# EAGLE design Plata2 (EAGLE 7.5.0)
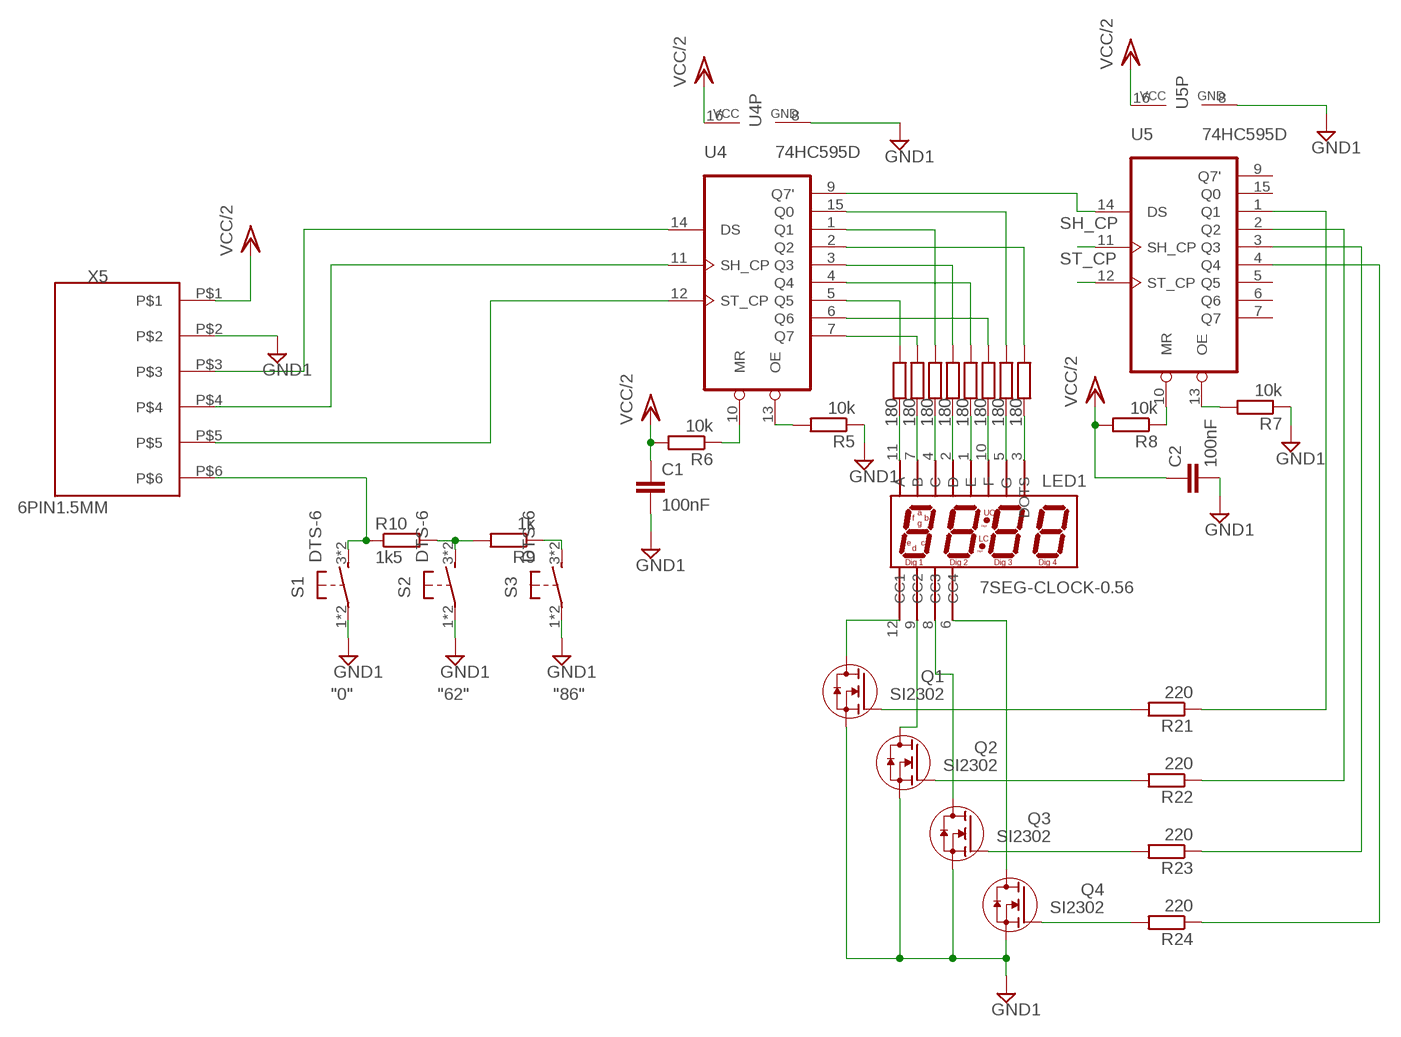
[diagram p0: schematic, sheet 1]

## Parts
C1  100nF  C-EUC0603  [C0603]
C2  100nF  C-EUC0603  [C0603]
LED1  7SEG-CLOCK-0.56  [7SEG_4DIG_0.56]
Q1  SI2302  [SOT-23-GSD]
Q2  SI2302  [SOT-23-GSD]
Q3  SI2302  [SOT-23-GSD]
Q4  SI2302  [SOT-23-GSD]
R5  10k  R-EU_R0805  [R0805]
R6  10k  R-EU_R0805  [R0805]
R7  10k  R-EU_R0805  [R0805]
R8  10k  R-EU_R0805  [R0805]
R9  1k  R-EU_R0805  [R0805]
R10  1k5  R-EU_R0805  [R0805]
R17  180  R-EU_R0805  [R0805]
R18  180  R-EU_R0805  [R0805]
R19  180  R-EU_R0805  [R0805]
R20  180  R-EU_R0805  [R0805]
R21  220  R-EU_R0805  [R0805]
R22  220  R-EU_R0805  [R0805]
R23  220  R-EU_R0805  [R0805]
R24  220  R-EU_R0805  [R0805]
R25  180  R-EU_R0805  [R0805]
R26  180  R-EU_R0805  [R0805]
R27  180  R-EU_R0805  [R0805]
R28  180  R-EU_R0805  [R0805]
S1  DTS-6  [DTS-6]
S2  DTS-6  [DTS-6]
S3  DTS-6  [DTS-6]
U4  74HC595D  [SO16]
U5  74HC595D  [SO16]
X5  6PIN1.5MM  [6PIN*1.5MM]

## Nets
GND1: C1.2 C2.2 Q1.S Q2.S Q3.S Q4.S R5.1 R7.1 S1.1 S1.2 S2.1 S2.2 S3.1 S3.2 U4.8(GND) U5.8(GND) X5.P$2
N$2: R9.2 R10.2 S2.3 S2.4
N$3: R9.1 S3.3 S3.4
N$6: R10.1 S1.3 S1.4 X5.P$6
N$9: R6.1 U4.10(MR)
N$11: U4.14(DS) X5.P$3
N$20: R5.2 U4.13(OE)
N$22: R8.1 U5.10(MR)
N$25: R7.2 U5.13(OE)
N$28: R17.1 U4.5(Q5)
N$29: R18.1 U4.7(Q7)
N$30: U4.9(Q7') U5.14(DS)
N$31: R19.1 U4.1(Q1)
N$32: R20.1 U4.3(Q3)
N$33: R25.1 U4.4(Q4)
N$34: R26.1 U4.6(Q6)
N$35: R27.1 U4.15(Q0)
N$36: R28.1 U4.2(Q2)
N$37: LED1.12(CC1) Q1.D
N$38: LED1.9(CC2) Q2.D
N$39: LED1.8(CC3) Q3.D
N$40: LED1.6(CC4) Q4.D
N$41: R21.1 U5.1(Q1)
N$42: R22.1 U5.2(Q2)
N$43: R23.1 U5.3(Q3)
N$44: R24.1 U5.4(Q4)
N$51: LED1.11(A) R17.2
N$52: LED1.7(B) R18.2
N$55: LED1.4(C) R19.2
N$57: LED1.2(D) R20.2
N$58: LED1.1(E) R25.2
N$59: LED1.10(F) R26.2
N$60: LED1.5(G) R27.2
N$61: LED1.3(DOTS) R28.2
N$65: Q4.G R24.2
N$66: Q3.G R23.2
N$67: Q2.G R22.2
N$68: Q1.G R21.2
SH_CP: U4.11(SH_CP) U5.11(SH_CP) X5.P$4
ST_CP: U4.12(ST_CP) U5.12(ST_CP) X5.P$5
VCC/2: C1.1 C2.1 R6.2 R8.2 U4.16(VCC) U5.16(VCC) X5.P$1
Unconnected: U5.5(Q5) U5.6(Q6) U5.7(Q7) U5.9(Q7') U5.15(Q0)

## Notes on the sheet
- "0" | "62" | "86"

## Library data of the parts
C1 C2 = rcl:C-EU: CAPACITOR, European symbol
LED1 = usb:7SEG-CLOCK-0.56
Q1-Q4 = usb:SI2302: N-канальный полевик
R5-R10 R17-R28 = rcl:R-EU_: RESISTOR, European symbol
S1-S3 = switch-tact:DTS-6
U4 U5 = 74xx-eu:74*595: 8-bit SHIFT REGISTER, output latch
X5 = usb:6PIN*1.5MM

## Board
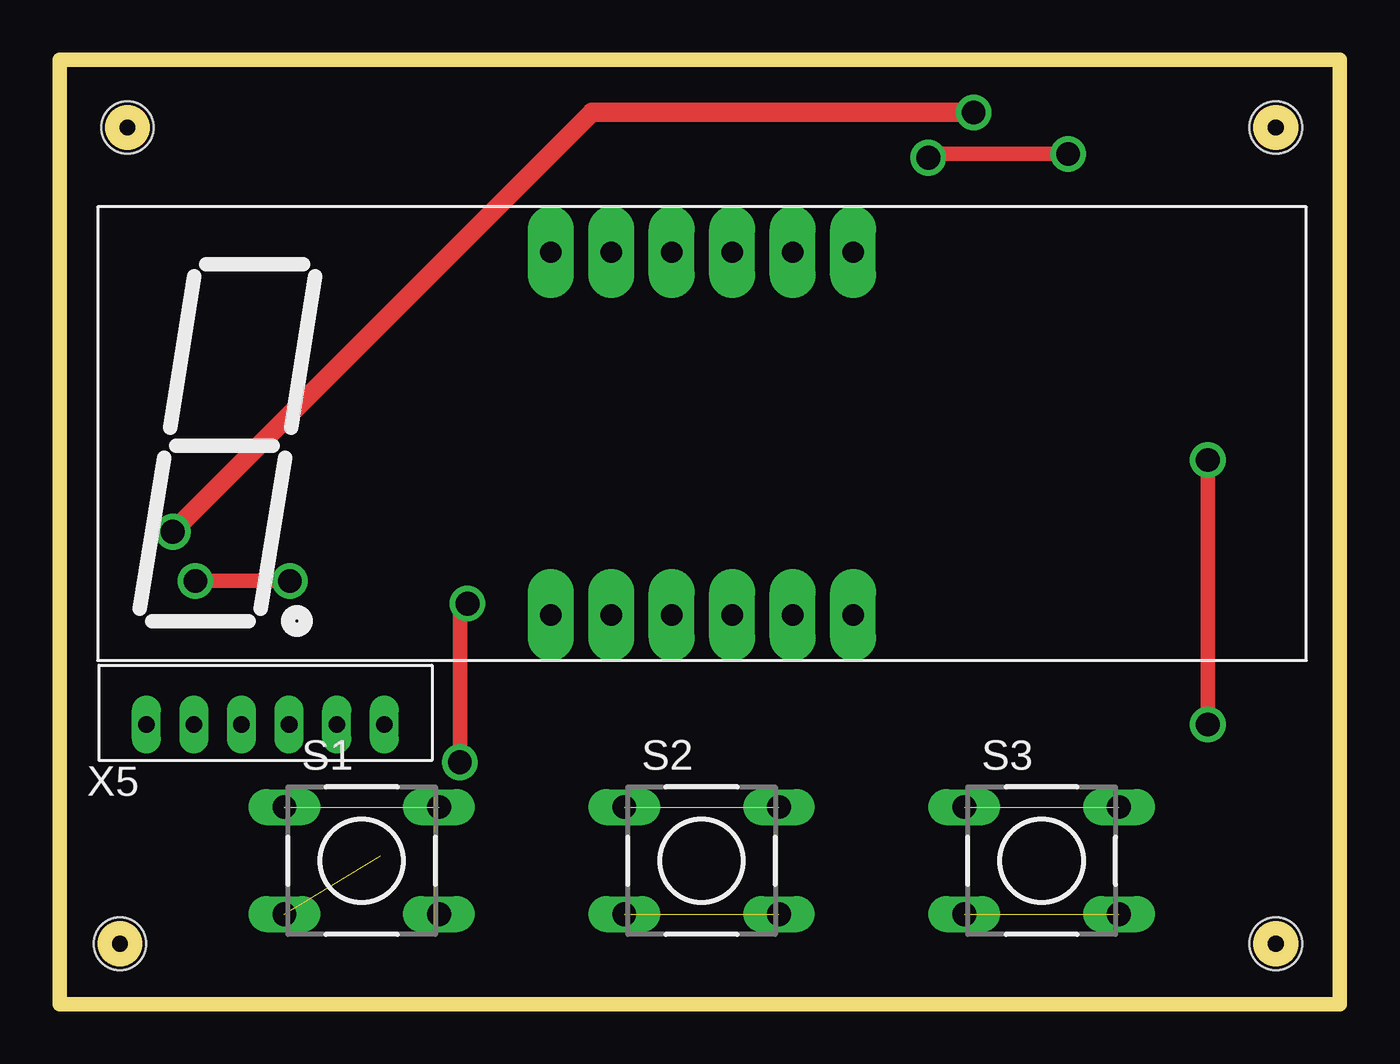
[diagram p1: board, top side]
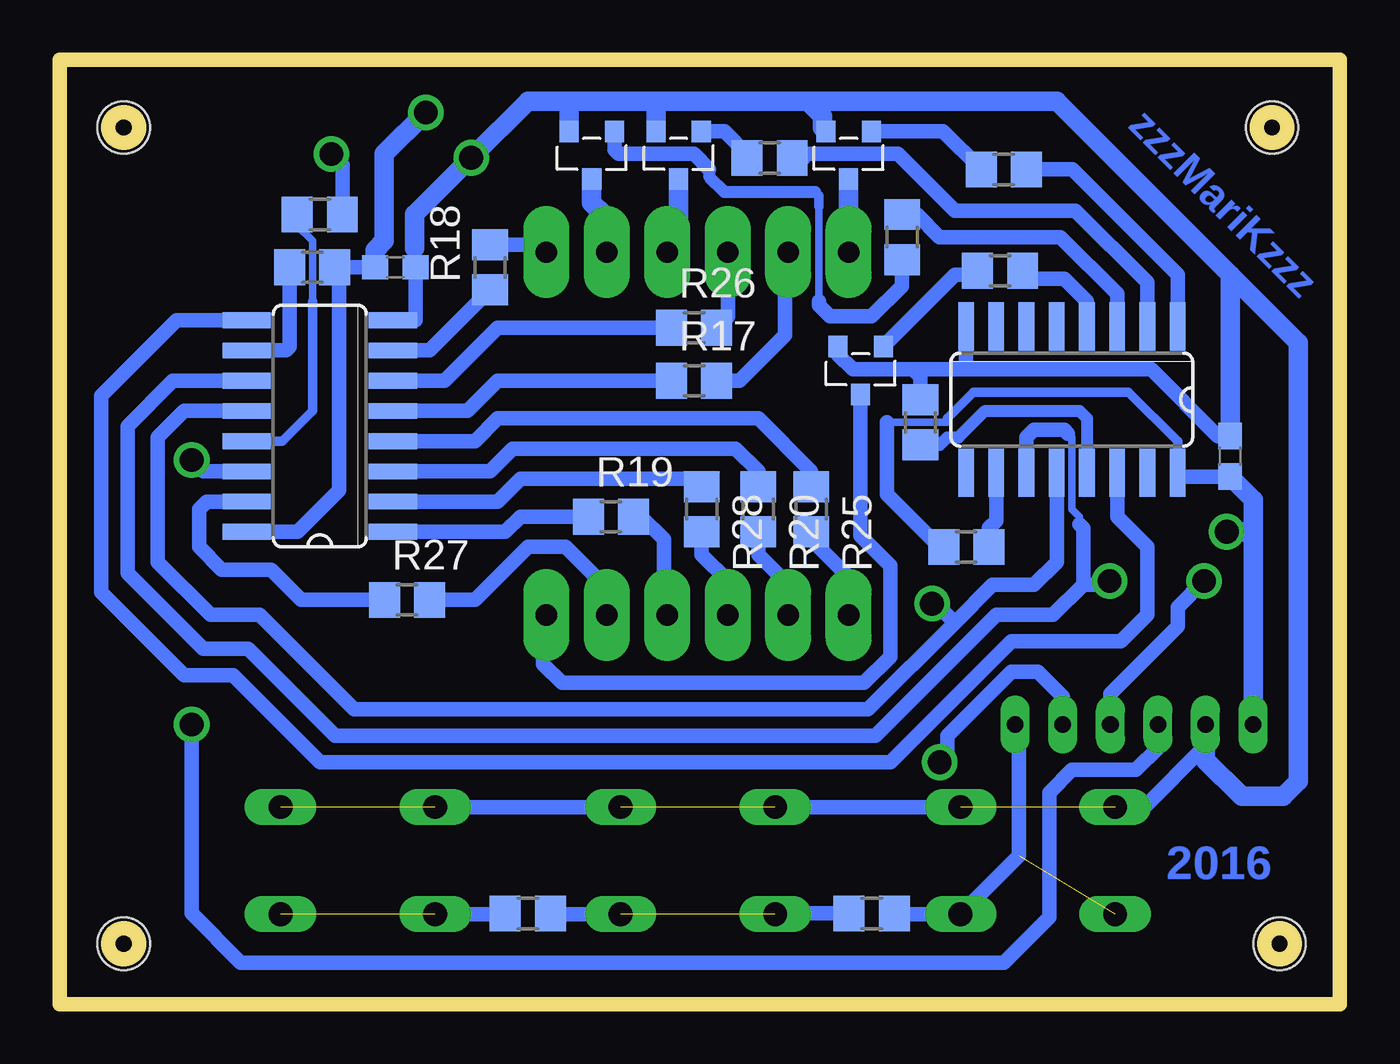
[diagram p2: board, bottom side, seen from below]

Size 53.82 x 39.69 mm. Coordinates in mm from the lower left corner, seen from the top.
Outline: 0,0 53.82,0 53.82,39.69 0,39.69 0,0
Outline: circle at 2.54,2.54 radius 0.64
Outline: circle at 2.86,36.83 radius 0.64
Outline: circle at 51.12,36.83 radius 0.64
Outline: circle at 51.12,2.54 radius 0.64
Copper layers (1*16): Top 0.035mm / dielectric 1.5mm / Bottom 0.035mm
Design rules "default": minimum track width 10mil, minimum drill 24mil, track to track 8mil, track to pad 8mil, pad to pad 8mil, via to via 8mil, smd to smd 8mil, copper to edge 40mil, drill to drill 8mil, minimum pad ring 10mil, minimum via ring 8mil, stop-mask expansion 4mil, vias tented up to drill 0mil, thermal gap 10mil
Holes 2.2 mm at 2.86,36.83 51.12,36.83 51.12,2.54 2.54,2.54

### Footprints (pad centres in the part's own frame; a part is rotated, then mirrored left to right if it is on the bottom)
C0603 = smd 1.1 x 1: 1 -0.85,0; 2 0.85,0
7SEG_4DIG_0.56 = drill 0.9 pad 1.93 long: 1 -5.08,-2.54; 2 -2.54,-2.54; 3 0,-2.54; 4 2.54,-2.54; 5 5.08,-2.54; 6 7.62,-2.54; 7 7.62,12.7; 8 5.08,12.7; 9 2.54,12.7; 10 0,12.7; 11 -2.54,12.7; 12 -5.08,12.7
SOT-23-GSD = smd 0.8 x 0.9: D 0,2; G -0.95,0; S 0.95,0
R0805 = smd 1.3 x 1.5: 1 -0.95,0; 2 0.95,0
DTS-6 = drill 1 long: 1 -3.25,2.25; 2 3.25,2.25; 3 -3.25,-2.25; 4 3.25,-2.25
SO16 = smd 0.66 x 2.032: 1 -4.445,-3.073; 2 -3.175,-3.073; 3 -1.905,-3.073; 4 -0.635,-3.073; 5 0.635,-3.073; 6 1.905,-3.073; 7 3.175,-3.073; 8 4.445,-3.073; 9 4.445,3.073; 10 3.175,3.073; 11 1.905,3.073; 12 0.635,3.073; 13 -0.635,3.073; 14 -1.905,3.073; 15 -3.175,3.073; 16 -4.445,3.073
6PIN*1.5MM = drill 0.7 long: P$1 0,0; P$2 0,2; P$3 0,4; P$4 0,6; P$5 0,8; P$6 0,10

### Placement (x,y rotation side)
C1  4.62,23.02 90 bottom
C2  39.7,30.96 0 bottom
LED1  25.73,18.89 0 top
Q1  20.65,36.67 180 bottom
Q2  27.8,36.67 180 bottom
Q3  31.45,36.67 180 bottom
Q4  20.15,27.62 180 bottom
R5  42.88,33.18 180 bottom
R6  43.19,30.96 0 bottom
R7  17.64,24.45 270 bottom
R8  15.7,19.21 180 bottom
R9  34.13,3.81 0 bottom
R10  19.68,3.81 180 bottom
R17  27.15,26.19 0 bottom
R18  35.72,30.96 90 bottom
R19  30.64,20.48 0 bottom
R20  24.45,20.8 270 bottom
R21  14.13,35.07 180 bottom
R22  23.97,35.55 180 bottom
R23  18.4,32.23 270 bottom
R24  14.29,30.81 180 bottom
R25  22.23,20.8 270 bottom
R26  27.15,28.42 0 bottom
R27  39.21,16.99 0 bottom
R28  26.83,20.8 270 bottom
S1  12.7,6.03 0 top
S2  26.99,6.03 0 top
S3  41.27,6.03 0 top
U4  42.88,24.29 90 bottom
U5  11.27,25.4 180 bottom
X5  3.65,11.75 270 top

### Tracks (layer width: path | path; a pad name or v marks a point on that pad's centre or on a via)
GND1  (via drill 1)  (3 unrouted)
  Top 0.61: v42.39,35.72 36.67,35.72 v36.51,35.56
  Bottom 0.61: U4.8 38.85,28.73 C2.2 38.89,31 38.89,31.75 | C1.2 5.14,23.87 7.94,26.67 15.88,26.67 | Q4.S 21.1,27.29 20.48,26.67 17.94,26.67 | 17.94,26.67 15.88,26.67 | R5.1 41.93,35.26 v42.39,35.72 | 15.88,26.67 15.72,26.83 U5.8 | R7.1 17.64,26.37 17.94,26.67 | S2.2 S3.1 | S1.2 S2.1 | S1.1 8.23,8.28 5.71,10.79 5.71,11.68 X5.P$2
  Bottom 0.813: Q3.S 32.4,37.77 32.23,37.94 | 32.23,37.94 28.1,37.94 | 28.1,37.94 22.38,37.94 | 22.38,37.94 21.75,37.31 21.75,36.82 Q1.S | Q2.S 28.75,37.93 28.1,37.94 | 38.89,31.75 38.89,33.18 v36.51,35.56 34.13,37.94 32.23,37.94 | C1.2 4.62,30.65 | 4.62,30.65 11.91,37.94 22.38,37.94 | X5.P$2 5.65,10.26 4.13,8.73 2.38,8.73 1.75,9.37 1.75,27.78 4.62,30.65
N$2  (1 unrouted)
  Bottom 0.61: R10.2 23.74,3.81 S2.3 | S2.4 33.18,3.78 R9.2
N$3  (1 unrouted)
  Bottom 0.61: S3.3 35.08,3.78 R9.1
N$6  (1 unrouted)
  Bottom 0.61: R10.1 18.73,3.78 S1.4 13.49,6.24 13.49,11.59 X5.P$6
N$9
  Bottom 0.61: R6.1 44.14,27.61 44.29,27.46 U4.10
N$11  (via drill 1)
  Top 0.61: v48.26,22.86 v48.26,11.75
  Bottom 0.61: U4.14 47.78,22.38 v48.26,22.86 | v48.26,11.75 48.26,3.81 46.2,1.75 14.13,1.75 12.22,3.65 12.22,8.89 11.27,9.84 8.57,9.84 7.62,10.79 7.62,11.72 X5.P$3
N$20
  Bottom 0.305: R5.2 43.83,32.71 43.18,32.07 43.18,29.53
  Bottom 0.406: 43.18,29.53 43.18,24.92 44.45,23.65 U4.13
N$22
  Bottom 0.61: R8.1 14.75,20.01 14.45,20.32 U5.10
N$25
  Bottom 0.508: R7.2 16.82,23.5 16.51,23.81 16.03,23.81 14.92,24.92 10.95,24.92 10.64,24.61 U5.13
N$28
  Bottom 0.61: U4.5 36.67,24.92 35.4,26.19 R17.1
N$29
  Bottom 0.61: U4.7 38.26,27.46 R18.1
N$30
  Bottom 0.61: U4.9 48.9,28.73 52.07,25.56 52.07,17.3 48.58,13.81 46.51,13.81 42.86,10.16 18.89,10.16 13.81,15.24 9.21,15.24 8.1,16.35 8.1,19.21 9.37,20.48 U5.14
N$31
  Bottom 0.61: R19.1 34.45,20.48 35.08,19.84 U4.1
N$32
  Bottom 0.61: U4.3 35.72,22.38 34.77,23.34 25.4,23.34 24.45,22.38 R20.1
N$33
  Bottom 0.61: U4.4 36.35,23.65 35.4,24.61 24.45,24.61 22.23,22.38 R25.1
N$34
  Bottom 0.61: U4.6 37.62,26.19 35.4,28.42 R26.1
N$35
  Bottom 0.61: R27.1 43.66,16.99 44.93,18.26 46.99,18.26 47.94,19.21 47.94,20.8 47.62,21.11 U4.15
N$36
  Bottom 0.61: U4.2 35.4,21.11 34.45,22.07 27.15,22.07 R28.1
N$37
  Bottom 0.813: Q1.D LED1.12
N$38
  Bottom 0.813: Q2.D 27.8,32.07 LED1.9
N$39
  Bottom 0.813: Q3.D 31.45,33.67 30.96,33.18 30.96,31.74 LED1.8
N$40
  Bottom 0.61: LED1.6 33.5,16.21 33.5,14.29 32.7,13.49 20,13.49 18.89,14.61 18.89,18.41 20.15,19.67 Q4.D
N$41
  Bottom 0.61: R21.1 11.26,35.07 6.83,30.64 U5.1
N$42
  Bottom 0.61: R22.1 22.56,35.55 22.38,35.72 18.57,35.72 16.19,33.34 11.11,33.34 8.1,30.32 U5.2
N$43
  Bottom 0.61: R23.1 17.78,33.18 16.83,32.23 11.75,32.23 9.37,29.84 U5.3
N$44
  Bottom 0.61: U5.4 10.64,29.53 11.59,30.48 13.01,30.48 R24.1
N$51
  Bottom 0.61: R17.2 25.24,26.19 23.34,28.1 23.34,31.45 LED1.11
N$52
  Bottom 0.61: R18.2 33.67,31.91 LED1.7
N$55
  Bottom 0.61: R19.2 29.37,20.48 28.42,19.53 28.42,16.5 LED1.4
N$57
  Bottom 0.61: R20.2 24.45,18.89 23.18,17.62 23.18,16.36 LED1.2
N$58
  Bottom 0.61: R25.2 22.23,19.53 20.64,17.94 20.64,16.36 LED1.1
N$59
  Bottom 0.61: LED1.10 25.73,28.88 R26.2
N$60
  Bottom 0.61: R27.2 36.35,16.99 34.13,19.21 32.54,19.21 30.64,17.3 30.64,16.52 LED1.5
N$61
  Bottom 0.61: R28.2 26.83,18.89 25.72,17.78 25.72,16.36 LED1.3
N$65
  Bottom 0.61: Q4.G 19.2,27.63 16.19,30.64 15.41,30.64 R24.2
N$66
  Bottom 0.305: 21.91,33.5 21.91,29.53
  Bottom 0.406: 22.07,34.13 21.91,33.97 21.91,33.5
  Bottom 0.508: 26.51,35.08 26.51,34.77 25.88,34.13 22.07,34.13
  Bottom 0.61: Q3.G 30.5,35.89 30.32,35.72 27.15,35.72 26.51,35.08 | 21.91,29.53 21.91,29.37 21.43,28.89 19.68,28.89 18.41,30.16 18.41,31.26 R23.2
N$67
  Bottom 0.61: R22.2 24.92,35.72 25.88,36.67 Q2.G
N$68
  Bottom 0.61: Q1.G 16.68,36.67 R21.2
SH_CP  (via drill 1)
  Top 0.61: v9.68,17.78 v5.71,17.78
  Bottom 0.305: 10.95,20.16 10.95,20.48 11.27,20.8 11.27,23.81 11.43,23.97
  Bottom 0.61: U4.11 49.05,26.19 50.96,24.29 50.96,18.1 47.78,14.92 45.88,14.92 42.23,11.27 19.53,11.27 14.45,16.35 12.06,16.35 10.79,17.62 | 10.79,17.62 10.79,20 10.95,20.16 | 11.43,23.97 11.59,24.13 12.86,24.13 13.18,23.81 U5.11 | 10.79,17.62 9.84,17.62 v9.68,17.78 | v5.71,17.78 6.83,16.67 6.83,15.88 9.65,13.05 X5.P$4
ST_CP  (via drill 1)
  Top 0.61: v16.83,10.16 16.83,16.51 v17.14,16.83
  Bottom 0.61: U4.12 48.58,24.92 49.69,23.81 49.69,18.57 47.47,16.35 45.4,16.35 41.43,12.38 19.84,12.38 16.19,16.03 | U5.12 11.91,18.57 12.86,17.62 14.61,17.62 16.19,16.03 | 16.19,16.03 16.99,16.83 v17.14,16.83 | X5.P$5 11.65,12.92 12.7,13.97 13.81,13.97 16.51,11.27 16.51,10.48 v16.83,10.16
VCC/2  (via drill 1)
  Top 0.813: v38.42,37.47 22.38,37.47 v4.76,19.84
  Bottom 0.305: 19.05,24.45 16.51,24.45 16.51,24.61
  Bottom 0.406: 16.51,24.61 15.4,25.72 8.89,25.72 6.83,23.65 U5.16
  Bottom 0.61: C2.1 R6.2 42.24,30.5 42.07,30.32 42.07,21.59 43.81,19.84 U4.16 | C1.1 6.67,22.17 U5.16 | R8.2 16.83,19.21 19.05,21.43 19.05,24.45
  Bottom 0.813: C2.1 40.55,31.68 40.16,32.07 40.16,35.72 v38.42,37.47 | X5.P$1 3.65,19.53 | 3.65,19.53 3.65,21.2 C1.1 | v4.76,19.84 3.97,19.84 3.65,19.53

### Text on the board
Bottom: zzzMariKzzz | 2016